# Altium schematic sheet dsPIC.SchDoc
size A
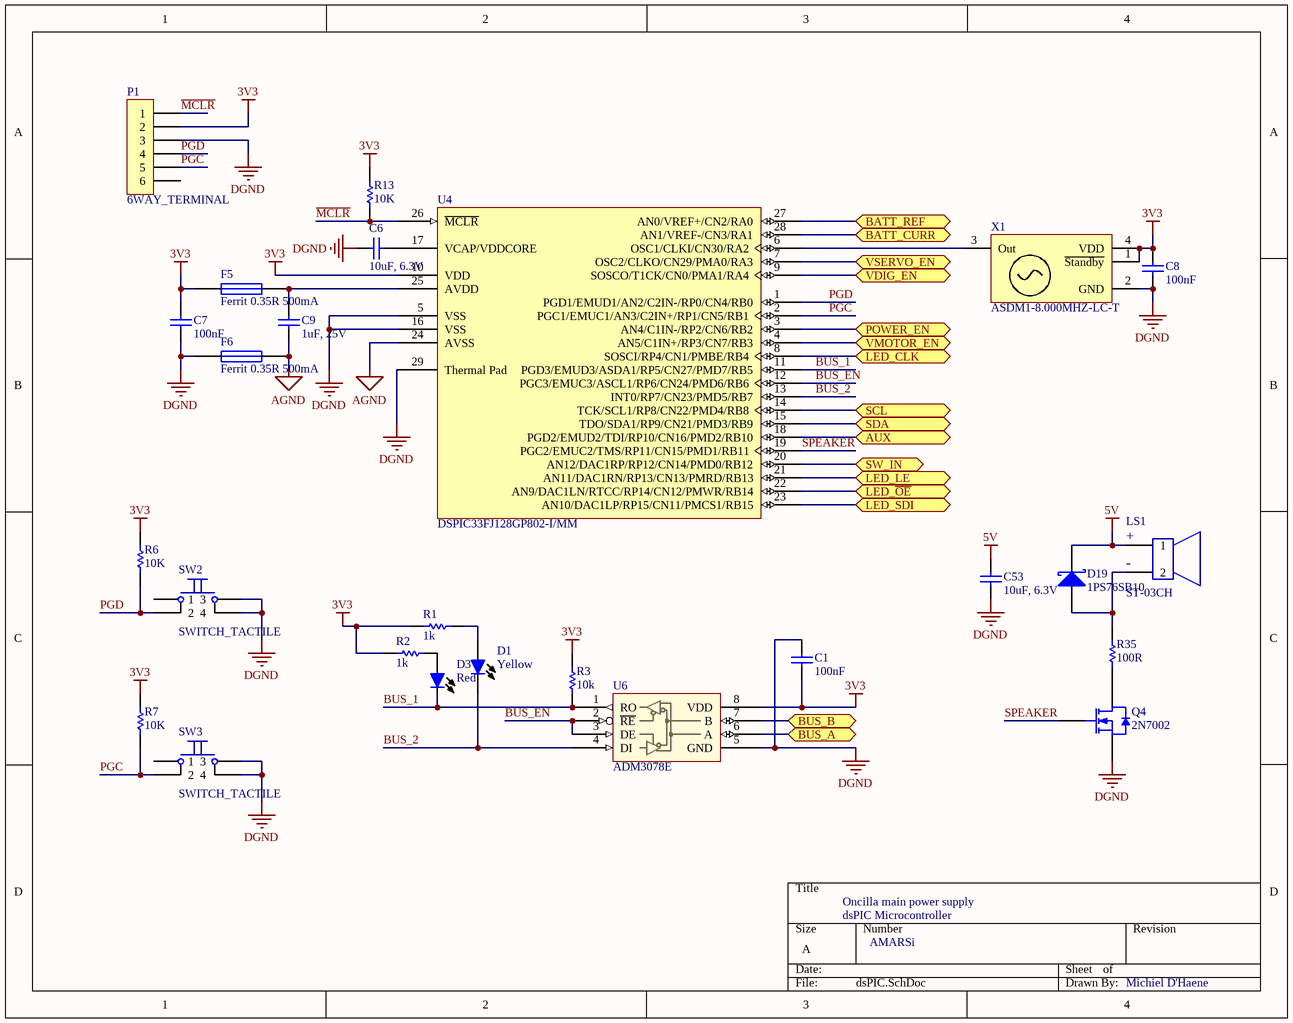
[diagram p0: dsPIC.SchDoc]

## Parts
C1  100nF  [CAPC1608L]
C6  10uF, 6.3V  [CAPC1608L]
C7  100nF  [CAPC1608L]
C8  100nF  [CAPC1608L]
C9  1uF, 25V  [CAPC1608L]
C53  value 10uF, 6.3V  [CAPC1608L]  (hidden comment: 1uF, 25V)
D1  Color: Yellow  [CD1608-0603]  (hidden comment: LED Yellow)
D3  Color: Red  [CD1608-0603]  (hidden comment: LED Red)
D19  1PS76SB10  [SOD323]
F5  Ferrit 0.35R 500mA  [RESC1608L]
F6  Ferrit 0.35R 500mA  [RESC1608L]
LS1  ST-03CH  [PIEZO_8.5x8.5MM]
P1  6WAY_TERMINAL  [MICROMATCH_6WAY_SE]
Q4  2N7002  [SOT23_N]
R1  1k  [RESC1608L]
R2  1k  [RESC1608L]
R3  10k  [RESC1608L]
R6  10k  [RESC1608L]
R7  10k  [RESC1608L]
R13  10k  [RESC1608L]
R35  100R  [RESC2012L]
SW2  SWITCH_TACTILE  [TACTILE_SWITCH]
SW3  SWITCH_TACTILE  [TACTILE_SWITCH]
U4  DSPIC33FJ128GP802-I/MM  [QFNS-MM28_N]
U6  ADM3078E  [SOIC-8_M]
X1  ASDM1-8.000MHZ-LC-T  [Crystal-Oscillator-2520]

## Ports
AUX, BATT_CURR, BATT_REF, BUS_A, BUS_B, LED_CLK, LED_LE, LED_SDI, LED_~{OE}, POWER_EN, SCL, SDA, SW_IN, VDIG_EN, VMOTOR_EN, VSERVO_EN

## Nets
3V3: C1.1 C7.2 C8.2 F5.1 P1.2 R1.1 R2.1 R3.2 R6.2 R7.2 R13.2 U4.10(VDD) U6.8(VDD) X1.1(~{Standby}) X1.4(VDD)
5V: C53.1 D19.1(K) LS1.1
AGND: C9.1 F6.2 U4.24(AVSS)
DGND: C1.2 C6.1 C7.1 C8.1 C53.2 F6.1 P1.3 Q4.2(S) SW2.3 SW2.4 SW3.3 SW3.4 U4.5(VSS) U4.16(VSS) U4.29(Thermal_Pad) U6.5(GND) X1.2(GND)
AUX: U4.18(PGD2/EMUD2/TDI/RP10/CN16/PMD2/RB10) ; port AUX
BATT_CURR: U4.28(AN1/VREF-/CN3/RA1) ; port BATT_CURR
BATT_REF: U4.27(AN0/VREF+/CN2/RA0) ; port BATT_REF
BUS_1: D3.2(C) R3.1 U4.11(PGD3/EMUD3/ASDA1/RP5/CN27/PMD7/RB5) U6.1(RO)
BUS_2: D1.2(C) U4.13(INT0/RP7/CN23/PMD5/RB7) U6.4(DI)
BUS_A: U6.6(A) ; port BUS_A
BUS_B: U6.7(B) ; port BUS_B
BUS_EN: U4.12(PGC3/EMUC3/ASCL1/RP6/CN24/PMD6/RB6) U6.2(~{RE}) U6.3(DE)
LED_CLK: U4.8(SOSCI/RP4/CN1/PMBE/RB4) ; port LED_CLK
LED_LE: U4.21(AN11/DAC1RN/RP13/CN13/PMRD/RB13) ; port LED_LE
LED_~{OE}: U4.22(AN9/DAC1LN/RTCC/RP14/CN12/PMWR/RB14) ; port LED_~{OE}
LED_SDI: U4.23(AN10/DAC1LP/RP15/CN11/PMCS1/RB15) ; port LED_SDI
~{MCLR}: P1.1 R13.1 U4.26(~{MCLR})
PGC: P1.5 R7.1 SW3.2 U4.2(PGC1/EMUC1/AN3/C2IN+/RP1/CN5/RB1)
PGD: P1.4 R6.1 SW2.2 U4.1(PGD1/EMUD1/AN2/C2IN-/RP0/CN4/RB0)
POWER_EN: U4.3(AN4/C1IN-/RP2/CN6/RB2) ; port POWER_EN
SCL: U4.14(TCK/SCL1/RP8/CN22/PMD4/RB8) ; port SCL
SDA: U4.15(TDO/SDA1/RP9/CN21/PMD3/RB9) ; port SDA
SPEAKER: Q4.1(G) U4.19(PGC2/EMUC2/TMS/RP11/CN15/PMD1/RB11)
SW_IN: U4.20(AN12/DAC1RP/RP12/CN14/PMD0/RB12) ; port SW_IN
VDIG_EN: U4.9(SOSCO/T1CK/CN0/PMA1/RA4) ; port VDIG_EN
VMOTOR_EN: U4.4(AN5/C1IN+/RP3/CN7/RB3) ; port VMOTOR_EN
VSERVO_EN: U4.7(OSC2/CLKO/CN29/PMA0/RA3) ; port VSERVO_EN
NetC6_2: C6.2 U4.17(VCAP/VDDCORE)
NetC9_2: C9.2 F5.2 U4.25(AVDD)
NetD1_1: D1.1(A) R1.2
NetD3_1: D3.1(A) R2.2
NetD19_2: D19.2(A) LS1.2 R35.1
NetQ4_3: Q4.3(D) R35.2
NetU4_6: U4.6(OSC1/CLKI/CN30/RA2) X1.3(Out)

Not connected (* = marked no-connect by the designer): P1 6; SW2 1; SW3 1

## Notes on the sheet
- Oncilla main power supply
- dsPIC Microcontroller
- AMARSi
- Michiel D'Haene
- (in symbol piezo_sounder) +; -

## Library data of the parts
C1 C6-C9 C53 = Cap Semi: Capacitor (Semiconductor SIM Model); Published: 8-Jun-2000; LatestRevisionDate: 29-May-2009; LatestRevisionNote: IPC-7351 Footprint Added.; PackageReference: C1206; Publisher: Altium Limited; PackageDescription: Chip Capacitor
  C1 C7 C8: Value: 100nF
  C6: Value: 10uF, 6.3V
  C9: Value: 1uF, 25V
D1 D3 = LED
D19 = 1PS76SB10: Schottky Barrier Diode; Published: 17-Sep-2003; LatestRevisionDate: 19-Mar-2004; LatestRevisionNote: Silkscreen size reduced.; DatasheetVersion: 14-Oct-1996; PackageVersion: May-1999; PackageReference: SOD323; Publisher: Altium Limited; PackageDescription: SOD-323/SC-76; 2 Leads; Body 1.7 x 1.3 mm, (LxW); ComponentLink1Description: Manufacturer Link; ComponentLink1URL: http://www.semiconductors.philips.com/; ComponentLink2Description: Datasheet; ComponentLink2URL: http://www.semiconductors.philips.com/acrobat/datasheets/1PS76SB10_2.pdf
F5 F6 = Fuse 1: Ferrit Bead; Published: 8-Jun-2000; LatestRevisionDate: 17-Jul-2002; LatestRevisionNote: Re-released for DXP Platform.; PackageReference: PIN-W2/E2.8; Publisher: Altium Limited
LS1 = piezo_sounder
Q4 = BST82: N-channel Enhancement Mode Field-effect Transistor; Published: 17-Sep-2003; LatestRevisionDate: 12-Dec-2006; LatestRevisionNote: IPC-7351 Footprint Added.; DatasheetVersion: 26-Jul-2000; PackageVersion: May-1999; PackageReference: SOT23; Publisher: Altium Limited; PackageDescription: 3-Pin SOT-23 Package 0.95 mm Pitch, 2.3 mm Lead Span; ComponentLink1Description: Manufacturer Link; ComponentLink1URL: http://www.semiconductors.philips.com/; ComponentLink2Description: Datasheet; ComponentLink2URL: http://www.semiconductors.philips.com/acrobat/datasheets/BST82-03.pdf
R1-R3 R6 R7 R13 R35 = Res Semi: Semiconductor Resistor; Published: 8-Jun-2000; LatestRevisionDate: 17-Jul-2002; LatestRevisionNote: Re-released for DXP Platform.; PackageReference: AXIAL-0.5; Publisher: Altium Limited
  R1 R2: Value: 1k
  R3: Value: 10k
  R6 R7 R13: Value: 10K
  R35: Value: 100R
U4 = DSPIC33FJ128GP802T-I/MM: High-Performance 16-bit Digital Signal Controller, 128 KB Flash, 16 KB RAM, 28-Pin QFN, Industrial Temperature, Tape and Reel; FirstPublished: 29-Jan-2009; LatestRevisionDate: 02-Dec-2009; LatestRevisionNote: Updated to datasheet revision D, Nov-2009; DatasheetVersion: revD, Nov-2009; PackageVersion: revBB, Aug-2009; PackageReference: QFNS-MM28; Publisher: Altium Limited; PackageDescription: 28-Lead Plastic Quad Flat, No Lead Package (MM) - 6x6x0.9 mm Body [QFN-S] with 0.40 mm Contact Length; Supplier 1: Digi-Key; Supplier Part Number 1: DSPIC33FJ128GP802T-I/MMTR-ND; Supplier 2: Newark; Supplier Part Number 2: 54M4502; ComponentLink1Description: Datasheet; ComponentLink1URL: http://ww1.microchip.com/downloads/en/DeviceDoc/70292D.pdf; ComponentLink2Description: Packaging Specification; ComponentLink2URL: http://www.microchip.com/stellent/groups/techpub_sg/documents/packagingspec/en012702.pdf; ComponentLink3Description: Microchip.com Home; ComponentLink3URL: http://www.microchip.com/
U6 = ADM3078E: Half-Duplex RS485 Transciever, 3.3V, 16Mbps
X1 = Oscillator: Name: ASDM1; Value: 8MHz